# Altium schematic sheet Block Diagram.SchDoc
size Letter; DrawnBy: K.Hong; Organization: UW Robotics; Address1: 200 University Avenue; Address2: Waterloo; Address3: Ontario; Address4: Canada N2L 3G6; SheetNumber: 1; SheetTotal: 9
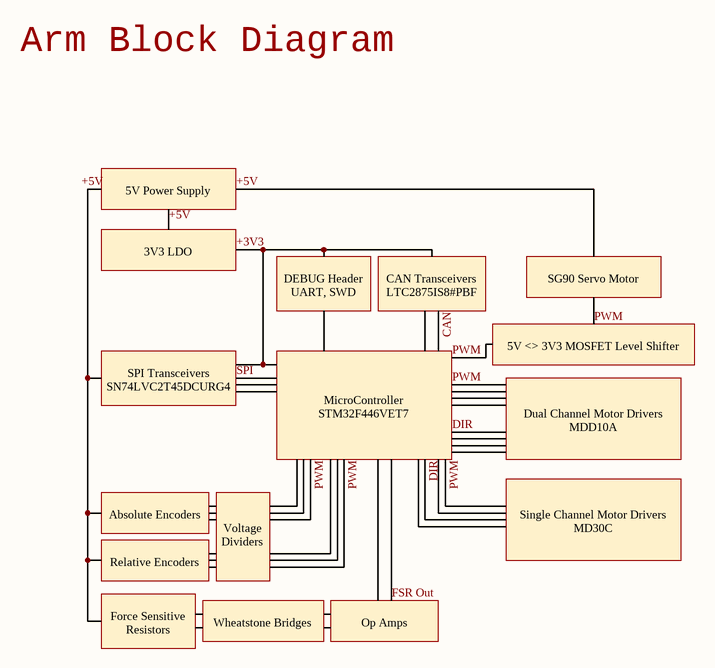
[diagram p0: Block Diagram.SchDoc]

## Notes on the sheet
- Arm Block Diagram
- 5V Power Supply
- 3V3 LDO
- DEBUG Header
  UART, SWD
- CAN Transceivers
  LTC2875IS8#PBF
- 5V <> 3V3 MOSFET Level Shifter
- SG90 Servo Motor
- SPI Transceivers
  SN74LVC2T45DCURG4
- MicroController
  STM32F446VET7
- Dual Channel Motor Drivers
  MDD10A
- Absolute Encoders
- Single Channel Motor Drivers
  MD30C
- Relative Encoders
- Voltage Dividers
- Force Sensitive Resistors
- Wheatstone Bridges
- Op Amps
- Labels drawn without touching a wire or pin: +5V
- Title
- Size:
- Date:
- Letter
- Drawn By:
- Sheet
- of
- File: